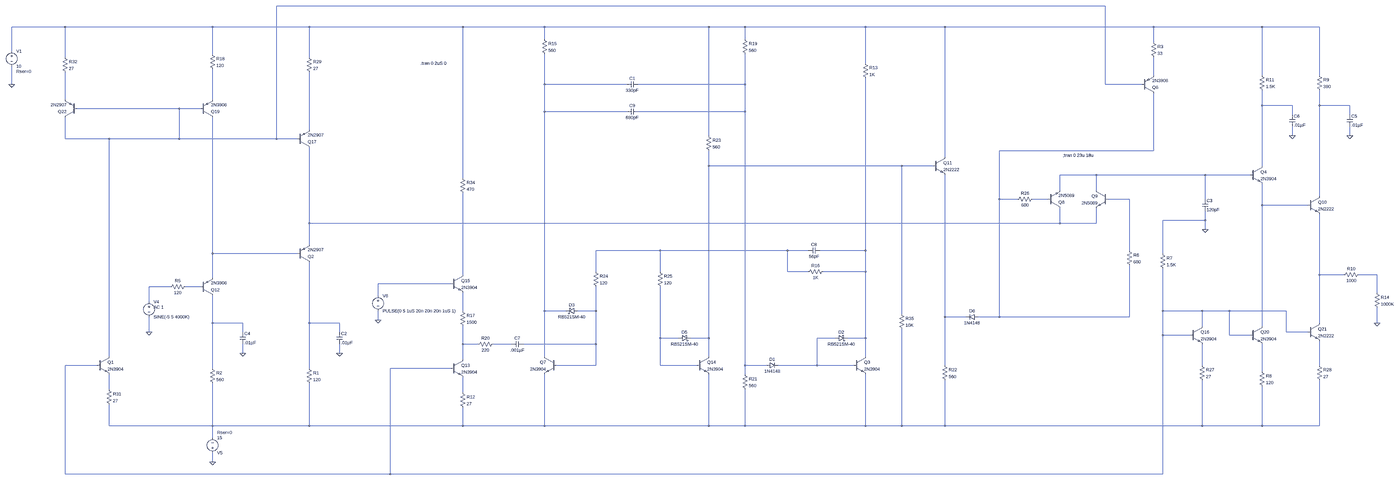
[diagram p0: schematic mimic_1575_follow_hold.asc, whole sheet]
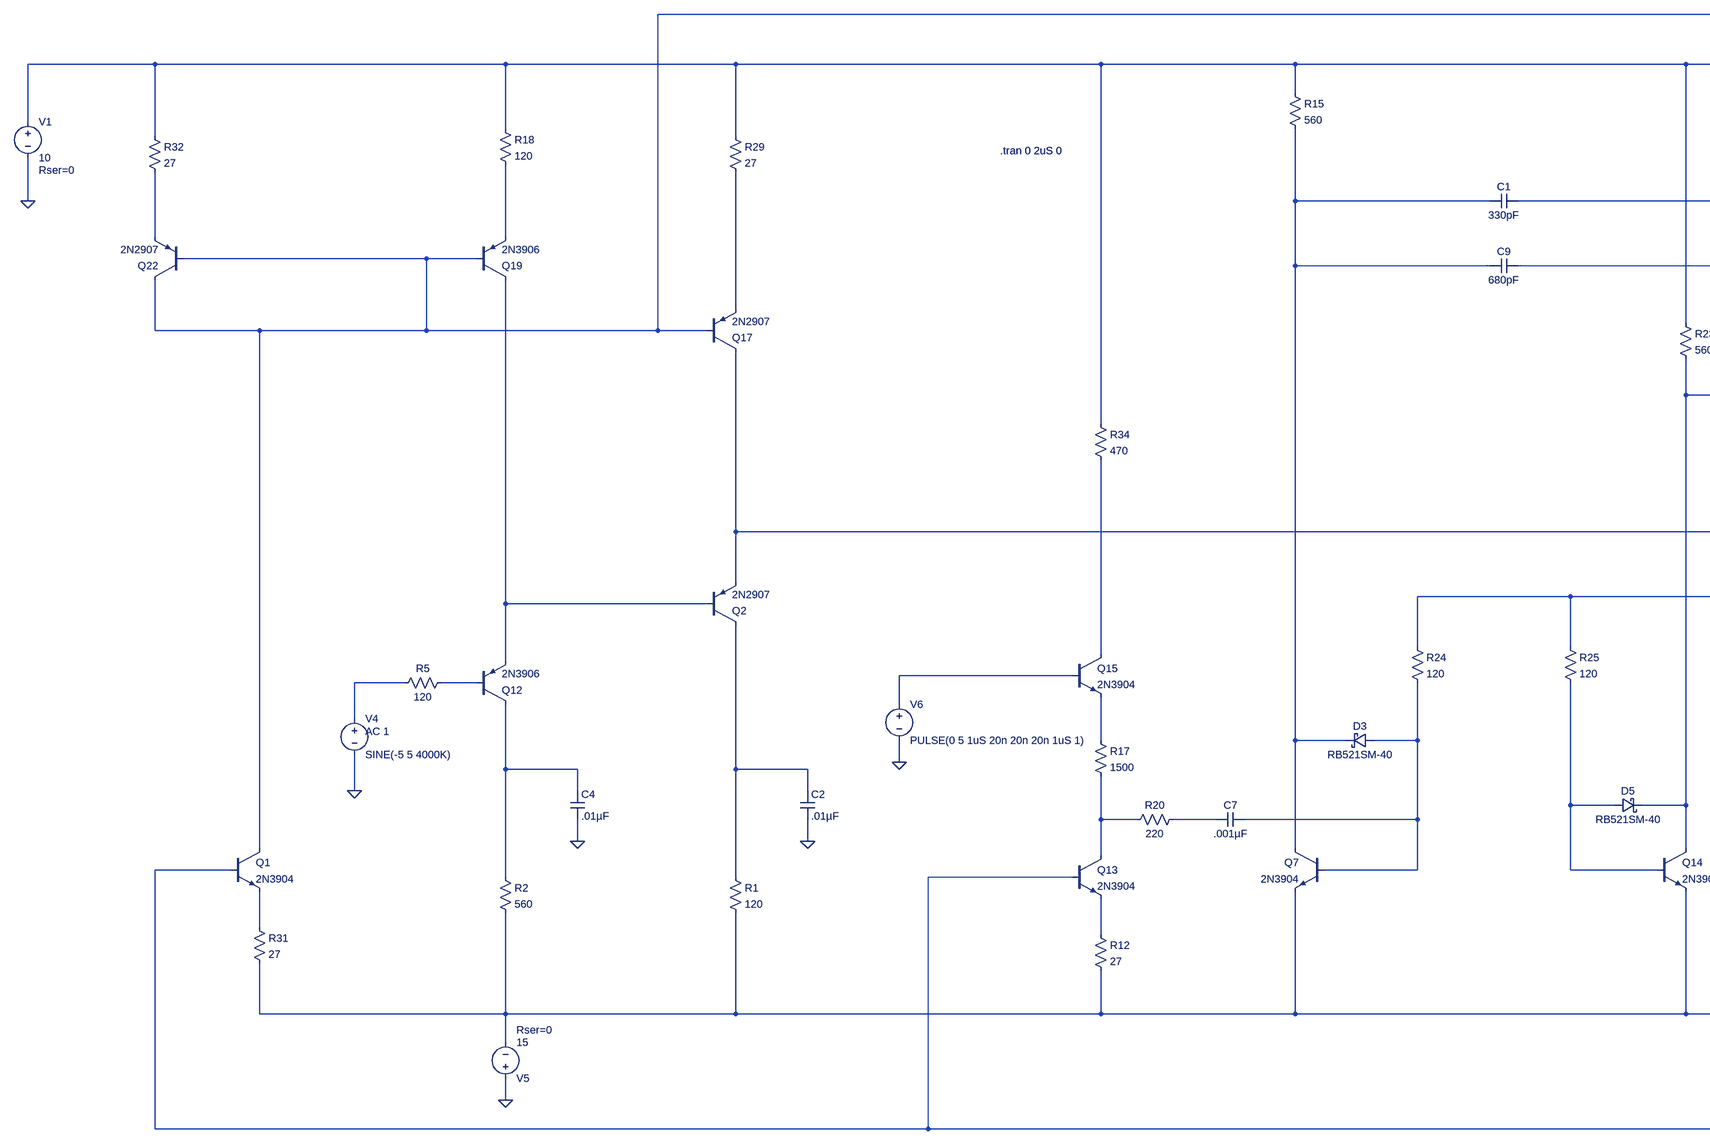
[diagram p1: schematic mimic_1575_follow_hold.asc, part, row 1 of 1, column 1 of 2]
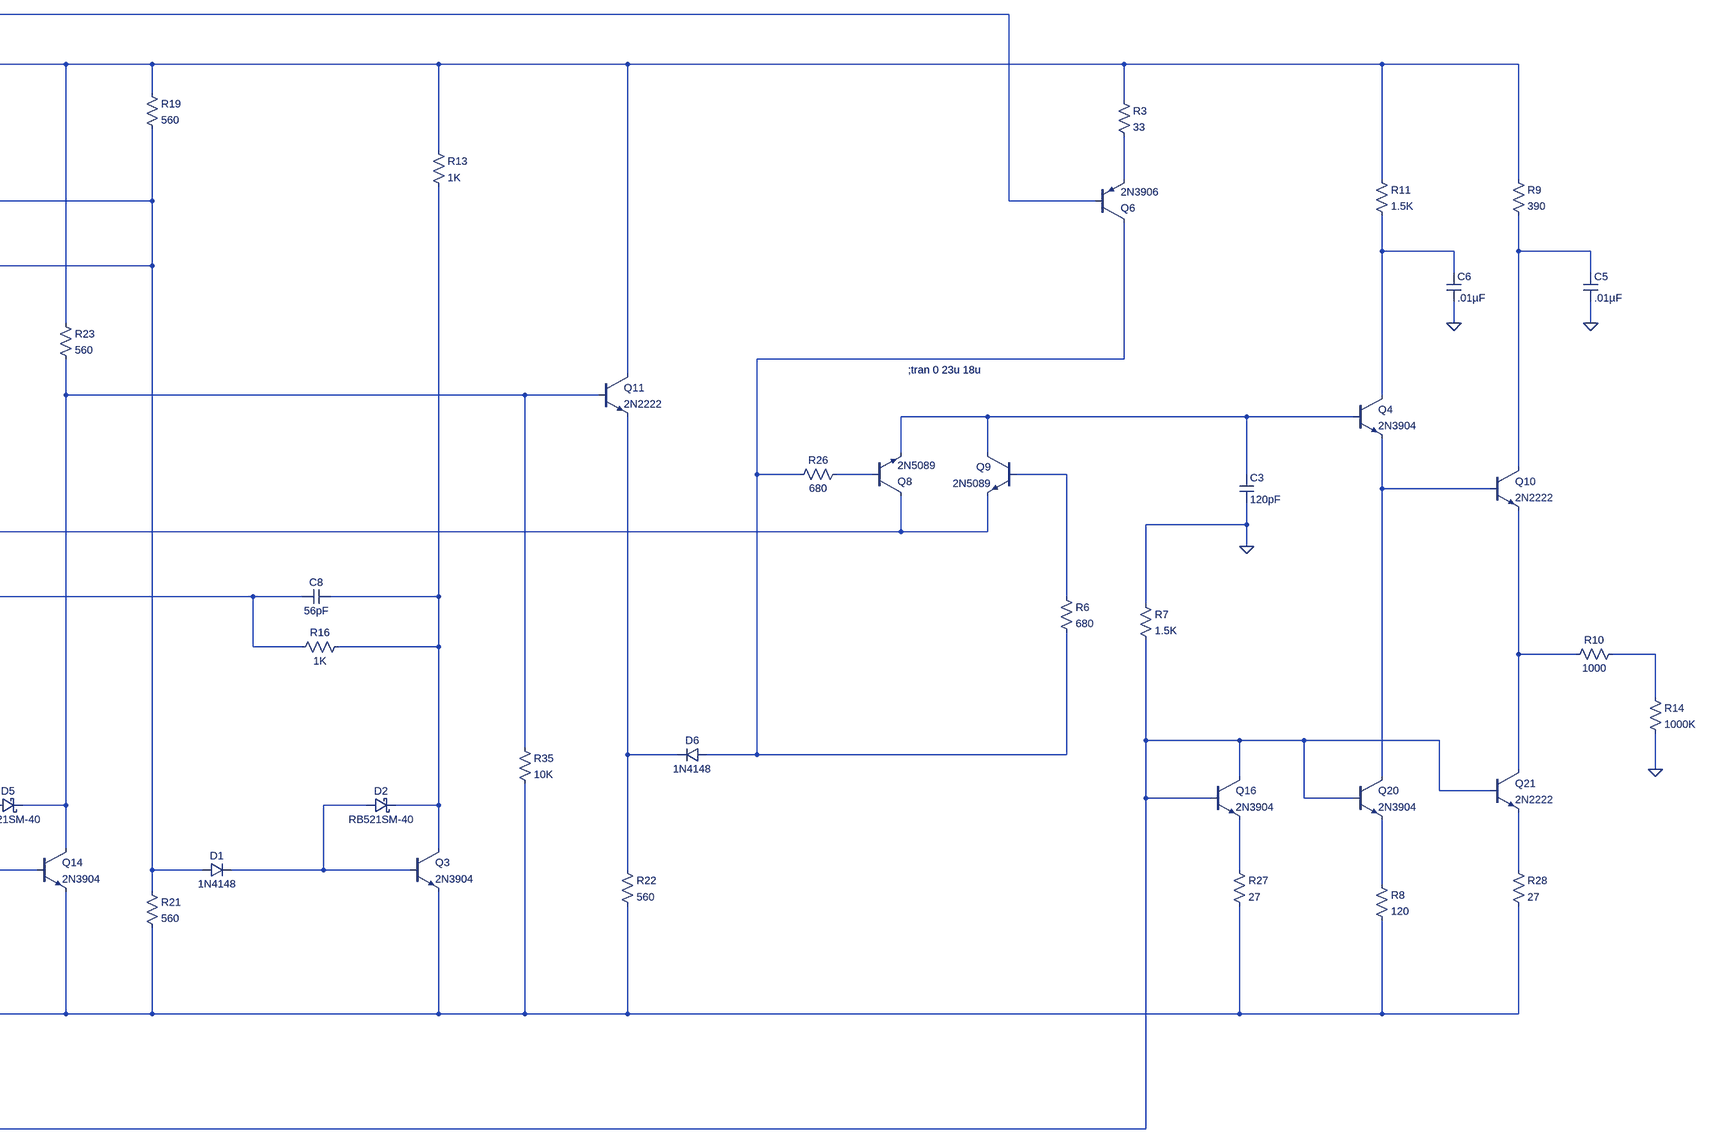
[diagram p2: schematic mimic_1575_follow_hold.asc, part, row 1 of 1, column 2 of 2]
mimic_1575_follow_hold.asc, the LTspice schematic file:
Version 4
SHEET 1 3484 2244
WIRE 1616 -2016 -3472 -2016
WIRE -4816 -1760 -5440 -1760
WIRE -3920 -1760 -4816 -1760
WIRE -3072 -1760 -3920 -1760
WIRE -2192 -1760 -3072 -1760
WIRE -1760 -1760 -2192 -1760
WIRE -832 -1760 -1760 -1760
WIRE -480 -1760 -832 -1760
WIRE 272 -1760 -480 -1760
WIRE 768 -1760 272 -1760
WIRE 1872 -1760 768 -1760
WIRE 2448 -1760 1872 -1760
WIRE 2752 -1760 2448 -1760
WIRE -1760 -1696 -1760 -1760
WIRE -480 -1696 -480 -1760
WIRE 1872 -1680 1872 -1760
WIRE -5440 -1632 -5440 -1760
WIRE -3920 -1616 -3920 -1760
WIRE -4816 -1600 -4816 -1760
WIRE -3072 -1600 -3072 -1760
WIRE 272 -1568 272 -1760
WIRE 1872 -1504 1872 -1600
WIRE 2448 -1504 2448 -1760
WIRE 2752 -1504 2752 -1760
WIRE -5440 -1456 -5440 -1552
WIRE -1760 -1456 -1760 -1616
WIRE -1328 -1456 -1760 -1456
WIRE -480 -1456 -480 -1616
WIRE -480 -1456 -1264 -1456
WIRE 1616 -1456 1616 -2016
WIRE 1808 -1456 1616 -1456
WIRE -4816 -1376 -4816 -1520
WIRE -3920 -1376 -3920 -1536
WIRE 2448 -1344 2448 -1424
WIRE 2608 -1344 2448 -1344
WIRE 2752 -1344 2752 -1424
WIRE 2912 -1344 2752 -1344
WIRE -4096 -1328 -4752 -1328
WIRE -3984 -1328 -4096 -1328
WIRE -1760 -1312 -1760 -1456
WIRE -1328 -1312 -1760 -1312
WIRE -480 -1312 -480 -1456
WIRE -480 -1312 -1264 -1312
WIRE 2608 -1296 2608 -1344
WIRE 2912 -1296 2912 -1344
WIRE -3072 -1216 -3072 -1520
WIRE -832 -1184 -832 -1760
WIRE 2608 -1184 2608 -1232
WIRE 2912 -1184 2912 -1232
WIRE -4816 -1168 -4816 -1280
WIRE -4480 -1168 -4816 -1168
WIRE -4096 -1168 -4096 -1328
WIRE -4096 -1168 -4480 -1168
WIRE -3472 -1168 -3472 -2016
WIRE -3472 -1168 -4096 -1168
WIRE -3136 -1168 -3472 -1168
WIRE 1872 -1104 1872 -1408
WIRE 1872 -1104 1056 -1104
WIRE 768 -1072 768 -1760
WIRE -832 -1024 -832 -1104
WIRE 512 -1024 -832 -1024
WIRE 704 -1024 512 -1024
WIRE 2448 -1024 2448 -1344
WIRE 1568 -976 1376 -976
WIRE 2144 -976 1568 -976
WIRE 2384 -976 2144 -976
WIRE -2192 -960 -2192 -1760
WIRE 1376 -896 1376 -976
WIRE 1568 -896 1568 -976
WIRE 2752 -864 2752 -1344
WIRE 1056 -848 1056 -1104
WIRE 1152 -848 1056 -848
WIRE 1312 -848 1232 -848
WIRE 1744 -848 1632 -848
WIRE 2144 -848 2144 -976
WIRE 2448 -816 2448 -928
WIRE 2688 -816 2448 -816
WIRE 2144 -736 2144 -784
WIRE 2144 -736 1920 -736
WIRE -3072 -720 -3072 -1120
WIRE 1376 -720 1376 -800
WIRE 1376 -720 -3072 -720
WIRE 1568 -720 1568 -800
WIRE 1568 -720 1376 -720
WIRE 2144 -688 2144 -736
WIRE -3072 -608 -3072 -720
WIRE -1088 -576 -1488 -576
WIRE -256 -576 -1088 -576
WIRE -32 -576 -256 -576
WIRE 272 -576 272 -1488
WIRE 272 -576 32 -576
WIRE 1744 -576 1744 -848
WIRE -3920 -560 -3920 -1280
WIRE -3136 -560 -3920 -560
WIRE 1920 -560 1920 -736
WIRE -1488 -464 -1488 -576
WIRE -1088 -464 -1088 -576
WIRE -256 -464 -256 -576
WIRE -32 -464 -256 -464
WIRE 272 -464 272 -576
WIRE 272 -464 48 -464
WIRE -2192 -448 -2192 -880
WIRE 2752 -448 2752 -768
WIRE 2880 -448 2752 -448
WIRE 3056 -448 2960 -448
WIRE -3920 -432 -3920 -560
WIRE -2256 -400 -2640 -400
WIRE -4144 -384 -4256 -384
WIRE -3984 -384 -4064 -384
WIRE 3056 -352 3056 -448
WIRE -2640 -336 -2640 -400
WIRE -4256 -304 -4256 -384
WIRE -2192 -256 -2192 -352
WIRE -1760 -256 -1760 -1312
WIRE -1648 -256 -1760 -256
WIRE -1488 -256 -1488 -384
WIRE -1488 -256 -1584 -256
WIRE 1920 -256 1920 -480
WIRE 2128 -256 1920 -256
WIRE 2272 -256 2128 -256
WIRE 2576 -256 2272 -256
WIRE 512 -240 512 -1024
WIRE 768 -224 768 -976
WIRE 880 -224 768 -224
WIRE 1056 -224 1056 -848
WIRE 1056 -224 944 -224
WIRE 1744 -224 1744 -496
WIRE 1744 -224 1056 -224
WIRE -2640 -208 -2640 -256
WIRE -3920 -192 -3920 -336
WIRE -3760 -192 -3920 -192
WIRE -3072 -192 -3072 -512
WIRE -2912 -192 -3072 -192
WIRE 2752 -192 2752 -448
WIRE 3056 -192 3056 -272
WIRE 2128 -176 2128 -256
WIRE 2448 -176 2448 -816
WIRE -4256 -144 -4256 -224
WIRE -3760 -144 -3760 -192
WIRE -2912 -144 -2912 -192
WIRE 2576 -144 2576 -256
WIRE 2688 -144 2576 -144
WIRE 1920 -128 1920 -256
WIRE 2064 -128 1920 -128
WIRE 2272 -128 2272 -256
WIRE 2384 -128 2272 -128
WIRE -1088 -112 -1088 -384
WIRE -992 -112 -1088 -112
WIRE -832 -112 -832 -1024
WIRE -832 -112 -928 -112
WIRE 112 -112 16 -112
WIRE 272 -112 272 -464
WIRE 272 -112 176 -112
WIRE -2192 -80 -2192 -176
WIRE -2112 -80 -2192 -80
WIRE -1936 -80 -2032 -80
WIRE -1488 -80 -1488 -256
WIRE -1488 -80 -1872 -80
WIRE -3760 -32 -3760 -80
WIRE -2912 -32 -2912 -80
WIRE -4480 -16 -4480 -1168
WIRE -1760 -16 -1760 -256
WIRE -832 -16 -832 -112
WIRE 272 -16 272 -112
WIRE -2192 0 -2192 -80
WIRE -4544 32 -4816 32
WIRE -1488 32 -1488 -80
WIRE -1488 32 -1696 32
WIRE -1088 32 -1088 -112
WIRE -896 32 -1088 32
WIRE -480 32 -480 -1312
WIRE -368 32 -480 32
WIRE 16 32 16 -112
WIRE 16 32 -304 32
WIRE 208 32 16 32
WIRE 768 32 768 -224
WIRE 2128 32 2128 -80
WIRE 2752 32 2752 -96
WIRE -3920 48 -3920 -192
WIRE -3072 48 -3072 -192
WIRE -2256 48 -2576 48
WIRE 2448 64 2448 -80
WIRE -480 80 -480 32
WIRE -4480 160 -4480 80
WIRE -2192 176 -2192 96
WIRE -4480 352 -4480 240
WIRE -3920 352 -3920 128
WIRE -3920 352 -4480 352
WIRE -3072 352 -3072 128
WIRE -3072 352 -3920 352
WIRE -2192 352 -2192 256
WIRE -2192 352 -3072 352
WIRE -1760 352 -1760 80
WIRE -1760 352 -2192 352
WIRE -832 352 -832 80
WIRE -832 352 -1760 352
WIRE -480 352 -480 160
WIRE -480 352 -832 352
WIRE 272 352 272 80
WIRE 272 352 -480 352
WIRE 512 352 512 -160
WIRE 512 352 272 352
WIRE 768 352 768 112
WIRE 768 352 512 352
WIRE 2128 352 2128 112
WIRE 2128 352 768 352
WIRE 2448 352 2448 144
WIRE 2448 352 2128 352
WIRE 2752 352 2752 112
WIRE 2752 352 2448 352
WIRE -3920 416 -3920 352
WIRE -3920 544 -3920 496
WIRE -4816 608 -4816 32
WIRE -2576 608 -2576 48
WIRE -2576 608 -4816 608
WIRE 1920 608 1920 -128
WIRE 1920 608 -2576 608
FLAG -3920 544 0
FLAG -4256 -144 0
FLAG 2144 -688 0
FLAG 3056 -192 0
FLAG -2912 -32 0
FLAG 2912 -1184 0
FLAG 2608 -1184 0
FLAG -2640 -208 0
FLAG -5440 -1456 0
FLAG -3760 -32 0
SYMBOL voltage -4256 -320 R0
WINDOW 123 24 44 Left 2
WINDOW 39 0 0 Left 2
SYMATTR Value2 AC 1
SYMATTR InstName V4
SYMATTR Value SINE(-5 5 4000K)
SYMBOL pnp -3984 -336 M180
SYMATTR InstName Q12
SYMATTR Value 2N3906
SYMBOL voltage -3920 512 M180
WINDOW 123 0 0 Left 2
WINDOW 39 24 124 Left 2
SYMATTR SpiceLine Rser=0
SYMATTR InstName V5
SYMATTR Value 15
SYMBOL res 1728 -592 R0
SYMATTR InstName R6
SYMATTR Value 680
SYMBOL cap 2128 -848 R0
SYMATTR InstName C3
SYMATTR Value 120pF
SYMATTR SpiceLine V=6.3 Irms=173m Rser=1.00156 Lser=0
SYMBOL res 2976 -464 R90
WINDOW 0 0 56 VBottom 2
WINDOW 3 32 56 VTop 2
SYMATTR InstName R10
SYMATTR Value 1000
SYMBOL res 3040 -368 R0
SYMATTR InstName R14
SYMATTR Value 1000K
SYMBOL npn 1312 -800 M180
SYMATTR InstName Q8
SYMATTR Value 2N5089
SYMBOL npn 1632 -896 M0
SYMATTR InstName Q9
SYMATTR Value 2N5089
SYMBOL npn 2688 -864 R0
SYMATTR InstName Q10
SYMATTR Value 2N2222
SYMBOL pnp -3136 -512 M180
SYMATTR InstName Q2
SYMATTR Value 2N2907
SYMBOL npn 2384 -1024 R0
SYMATTR InstName Q4
SYMATTR Value 2N3904
SYMBOL res -4048 -400 R90
WINDOW 0 0 56 VBottom 2
WINDOW 3 32 56 VTop 2
SYMATTR InstName R5
SYMATTR Value 120
SYMBOL res -3088 32 R0
SYMATTR InstName R1
SYMATTR Value 120
SYMBOL cap -2928 -144 R0
SYMATTR InstName C2
SYMATTR Value .01µF
SYMBOL res -3936 32 R0
SYMATTR InstName R2
SYMATTR Value 560
SYMBOL res 2736 -1520 R0
SYMATTR InstName R9
SYMATTR Value 390
SYMBOL cap 2896 -1296 R0
SYMATTR InstName C5
SYMATTR Value .01µF
SYMBOL res 2432 -1520 R0
SYMATTR InstName R11
SYMATTR Value 1.5K
SYMBOL cap 2592 -1296 R0
SYMATTR InstName C6
SYMATTR Value .01µF
SYMBOL pnp 1808 -1408 M180
SYMATTR InstName Q6
SYMATTR Value 2N3906
SYMBOL npn 208 -16 R0
SYMATTR InstName Q3
SYMATTR Value 2N3904
SYMBOL npn -1696 -16 M0
SYMATTR InstName Q7
SYMATTR Value 2N3904
SYMBOL res 256 -1584 R0
SYMATTR InstName R13
SYMATTR Value 1K
SYMBOL res -1776 -1712 R0
SYMATTR InstName R15
SYMATTR Value 560
SYMBOL cap -1264 -1472 R90
WINDOW 0 0 32 VBottom 2
WINDOW 3 32 32 VTop 2
SYMATTR InstName C1
SYMATTR Value 330pF
SYMBOL res 64 -480 R90
WINDOW 0 0 56 VBottom 2
WINDOW 3 32 56 VTop 2
SYMATTR InstName R16
SYMATTR Value 1K
SYMBOL cap -1872 -96 R90
WINDOW 0 0 32 VBottom 2
WINDOW 3 32 32 VTop 2
SYMATTR InstName C7
SYMATTR Value .001µF
SYMBOL voltage -2640 -352 R0
WINDOW 123 0 0 Left 2
WINDOW 39 0 0 Left 2
SYMATTR InstName V6
SYMATTR Value PULSE(0 5 1uS 20n 20n 20n 1uS 1)
SYMBOL res -496 -1712 R0
SYMATTR InstName R19
SYMATTR Value 560
SYMBOL res -2016 -96 R90
WINDOW 0 0 56 VBottom 2
WINDOW 3 32 56 VTop 2
SYMATTR InstName R20
SYMATTR Value 220
SYMBOL diode -368 16 M90
WINDOW 0 0 32 VBottom 2
WINDOW 3 32 32 VTop 2
SYMATTR InstName D1
SYMATTR Value 1N4148
SYMBOL schottky 112 -128 M90
WINDOW 0 0 32 VBottom 2
WINDOW 3 32 32 VTop 2
SYMATTR InstName D2
SYMATTR Value RB521SM-40
SYMATTR Description Diode
SYMATTR Type diode
SYMBOL schottky -1584 -272 R90
WINDOW 0 0 32 VBottom 2
WINDOW 3 32 32 VTop 2
SYMATTR InstName D3
SYMATTR Value RB521SM-40
SYMATTR Description Diode
SYMATTR Type diode
SYMBOL res -496 64 R0
SYMATTR InstName R21
SYMATTR Value 560
SYMBOL cap 32 -592 R90
WINDOW 0 0 32 VBottom 2
WINDOW 3 32 32 VTop 2
SYMATTR InstName C8
SYMATTR Value 56pF
SYMBOL npn 704 -1072 R0
SYMATTR InstName Q11
SYMATTR Value 2N2222
SYMBOL res 752 16 R0
SYMATTR InstName R22
SYMATTR Value 560
SYMBOL diode 944 -208 M270
WINDOW 0 32 32 VTop 2
WINDOW 3 0 32 VBottom 2
SYMATTR InstName D6
SYMATTR Value 1N4148
SYMBOL res -848 -1200 R0
SYMATTR InstName R23
SYMATTR Value 560
SYMBOL res -1504 -480 R0
SYMATTR InstName R24
SYMATTR Value 120
SYMBOL res -1104 -480 R0
SYMATTR InstName R25
SYMATTR Value 120
SYMBOL npn -896 -16 R0
SYMATTR InstName Q14
SYMATTR Value 2N3904
SYMBOL schottky -992 -128 M90
WINDOW 0 0 32 VBottom 2
WINDOW 3 32 32 VTop 2
SYMATTR InstName D5
SYMATTR Value RB521SM-40
SYMATTR Description Diode
SYMATTR Type diode
SYMBOL npn -2256 0 R0
SYMATTR InstName Q13
SYMATTR Value 2N3904
SYMBOL npn -2256 -448 R0
SYMATTR InstName Q15
SYMATTR Value 2N3904
SYMBOL res -2208 -272 R0
SYMATTR InstName R17
SYMATTR Value 1500
SYMBOL pnp -3136 -1120 M180
SYMATTR InstName Q17
SYMATTR Value 2N2907
SYMBOL voltage -5440 -1648 R0
WINDOW 123 0 0 Left 2
WINDOW 39 24 124 Left 2
SYMATTR SpiceLine Rser=0
SYMATTR InstName V1
SYMATTR Value 10
SYMBOL pnp -3984 -1280 M180
SYMATTR InstName Q19
SYMATTR Value 2N3906
SYMBOL cap -3776 -144 R0
SYMATTR InstName C4
SYMATTR Value .01µF
SYMBOL res -3936 -1632 R0
SYMATTR InstName R18
SYMATTR Value 120
SYMBOL res 1248 -864 R90
WINDOW 0 0 56 VBottom 2
WINDOW 3 32 56 VTop 2
SYMATTR InstName R26
SYMATTR Value 680
SYMBOL npn 2064 -176 R0
SYMATTR InstName Q16
SYMATTR Value 2N3904
SYMBOL npn 2384 -176 R0
SYMATTR InstName Q20
SYMATTR Value 2N3904
SYMBOL npn 2688 -192 R0
SYMATTR InstName Q21
SYMATTR Value 2N2222
SYMBOL res 2432 48 R0
SYMATTR InstName R8
SYMATTR Value 120
SYMBOL pnp -4752 -1280 R180
SYMATTR InstName Q22
SYMATTR Value 2N2907
SYMBOL res 1856 -1696 R0
SYMATTR InstName R3
SYMATTR Value 33
SYMBOL res 2112 16 R0
SYMATTR InstName R27
SYMATTR Value 27
SYMBOL res 2736 16 R0
SYMATTR InstName R28
SYMATTR Value 27
SYMBOL res -3088 -1616 R0
SYMATTR InstName R29
SYMATTR Value 27
SYMBOL res -4832 -1616 R0
SYMATTR InstName R32
SYMATTR Value 27
SYMBOL res -2208 -976 R0
SYMATTR InstName R34
SYMATTR Value 470
SYMBOL res 496 -256 R0
SYMATTR InstName R35
SYMATTR Value 10K
SYMBOL res 1904 -576 R0
SYMATTR InstName R7
SYMATTR Value 1.5K
SYMBOL res -2208 160 R0
SYMATTR InstName R12
SYMATTR Value 27
SYMBOL npn -4544 -16 R0
SYMATTR InstName Q1
SYMATTR Value 2N3904
SYMBOL res -4496 144 R0
SYMATTR InstName R31
SYMATTR Value 27
SYMBOL cap -1264 -1328 R90
WINDOW 0 0 32 VBottom 2
WINDOW 3 32 32 VTop 2
SYMATTR InstName C9
SYMATTR Value 680pF
TEXT 1392 -1080 Left 2 !;tran 0 23u 18u
TEXT -2416 -1568 Left 2 !.tran 0 2uS 0

The netlist it stands for:
* mimic_1575_follow_hold.asc
V4 N025 0 SINE(-5 5 4000K) AC 1
Q12 N031 N026 N020 0 2N3906
V5 0 N042 15 Rser=0
R6 N015 N011 680
C3 N013 0 120pF V=6.3 Irms=173m Rser=1.00156 Lser=0
R10 N023 N022 1000
R14 N023 0 1000K
Q8 N017 N014 N013 0 2N5089
Q9 N013 N015 N017 0 2N5089
Q10 N009 N016 N022 0 2N2222
Q2 N032 N020 N017 0 2N2907
Q4 N008 N013 N016 0 2N3904
R5 N026 N025 120
R1 N032 N042 120
C2 N032 0 .01µF
R2 N031 N042 560
R9 N002 N009 390
C5 N009 0 .01µF
R11 N002 N008 1.5K
C6 N008 0 .01µF
Q6 N011 N001 N003 0 2N3906
Q3 N019 N034 N042 0 2N3904
Q7 N004 N028 N042 0 2N3904
R13 N002 N019 1K
R15 N002 N004 560
C1 N005 N004 330pF
R16 N019 N018 1K
C7 N028 N036 .001µF
V6 N024 0 PULSE(0 5 1uS 20n 20n 20n 1uS 1)
R19 N002 N005 560
R20 N036 N035 220
D1 N005 N034 1N4148
D2 N034 N019 RB521SM-40
D3 N028 N004 RB521SM-40
R21 N005 N042 560
C8 N019 N018 56pF
Q11 N002 N012 N030 0 2N2222
R22 N030 N042 560
D6 N011 N030 1N4148
R23 N002 N012 560
R24 N018 N028 120
R25 N018 N033 120
Q14 N012 N033 N042 0 2N3904
D5 N033 N012 RB521SM-40
Q13 N035 N029 N041 0 2N3904
Q15 N021 N024 N027 0 2N3904
R17 N027 N035 1500
Q17 N017 N001 N010 0 2N2907
V1 N002 0 10 Rser=0
Q19 N020 N001 N007 0 2N3906
C4 N031 0 .01µF
R18 N002 N007 120
R26 N014 N011 680
Q16 N029 N029 N037 0 2N3904
Q20 N016 N029 N039 0 2N3904
Q21 N022 N029 N038 0 2N2222
R8 N039 N042 120
Q22 N001 N001 N006 0 2N2907
R3 N002 N003 33
R27 N037 N042 27
R28 N038 N042 27
R29 N002 N010 27
R32 N002 N006 27
R34 N002 N021 470
R35 N012 N042 10K
R7 0 N029 1.5K
R12 N041 N042 27
Q1 N001 N029 N040 0 2N3904
R31 N040 N042 27
C9 N005 N004 680pF
.model D D
.lib standard.dio
.model NPN NPN
.model PNP PNP
.lib standard.bjt
;tran 0 23u 18u
.tran 0 2uS 0
.backanno
.end